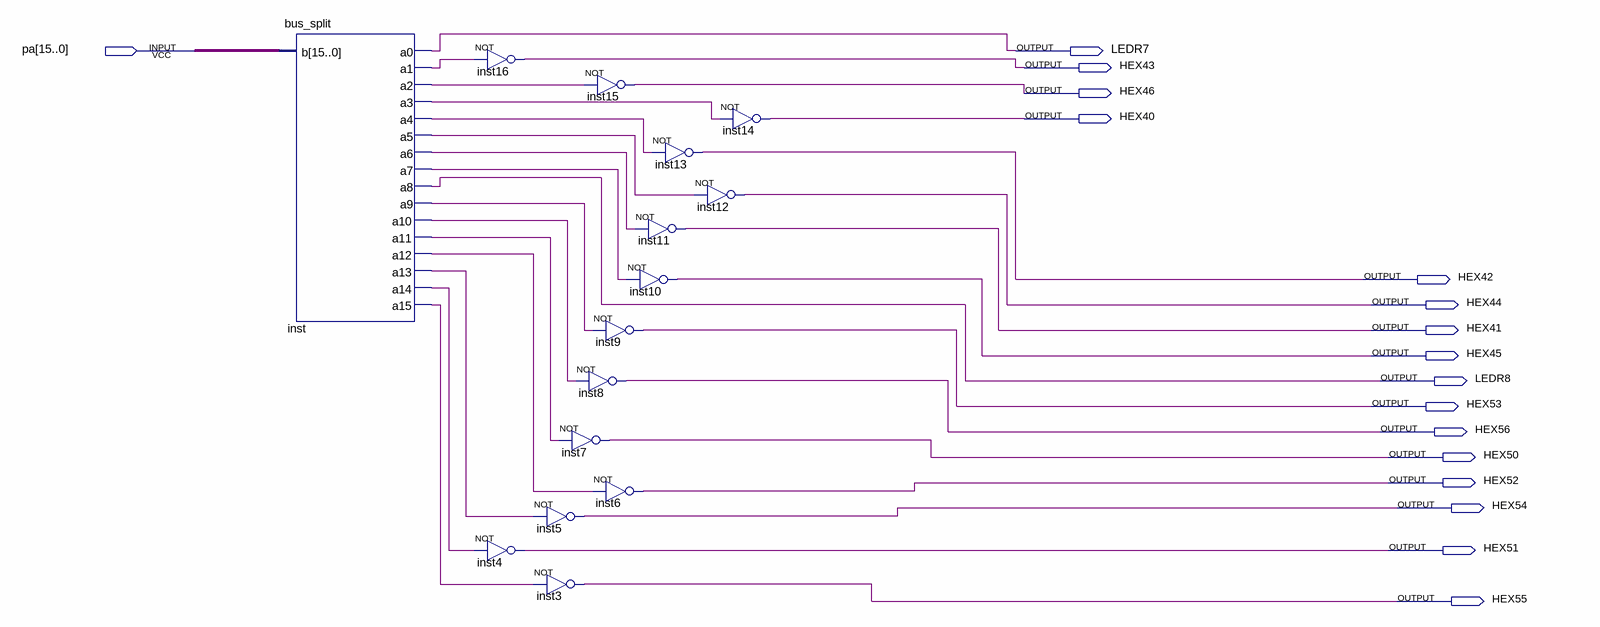
[diagram p0: schematic sheet]
// Quartus schematic display2.bdf as structural Verilog: 15 symbols, 17 pins
module display2 (
  input  [15:0] pa,
  output LEDR7,
  output HEX43,
  output HEX46,
  output HEX40,
  output HEX42,
  output HEX44,
  output HEX41,
  output HEX45,
  output LEDR8,
  output HEX53,
  output HEX56,
  output HEX50,
  output HEX52,
  output HEX54,
  output HEX51,
  output HEX55
);

  wire inst_a1, inst_a2, inst_a3, inst_a4, inst_a5, inst_a6, inst_a7, inst_a9, inst_a10, inst_a11, inst_a12,
       inst_a13, inst_a14, inst_a15;

  bus_split inst (
    .b(pa), .a0(LEDR7), .a1(inst_a1), .a2(inst_a2), .a3(inst_a3), .a4(inst_a4), .a5(inst_a5), .a6(inst_a6),
    .a7(inst_a7), .a8(LEDR8), .a9(inst_a9), .a10(inst_a10), .a11(inst_a11), .a12(inst_a12), .a13(inst_a13),
    .a14(inst_a14), .a15(inst_a15));
  not inst16 (HEX43, inst_a1);
  not inst5 (HEX54, inst_a13);
  not inst4 (HEX51, inst_a14);
  not inst3 (HEX55, inst_a15);
  not inst15 (HEX46, inst_a2);
  not inst9 (HEX53, inst_a9);
  not inst8 (HEX56, inst_a10);
  not inst7 (HEX50, inst_a11);
  not inst6 (HEX52, inst_a12);
  not inst13 (HEX42, inst_a4);
  not inst11 (HEX41, inst_a6);
  not inst10 (HEX45, inst_a7);
  not inst14 (HEX40, inst_a3);
  not inst12 (HEX44, inst_a5);
endmodule
